# EAGLE design PS2Kbd (EAGLE 6.5.0)
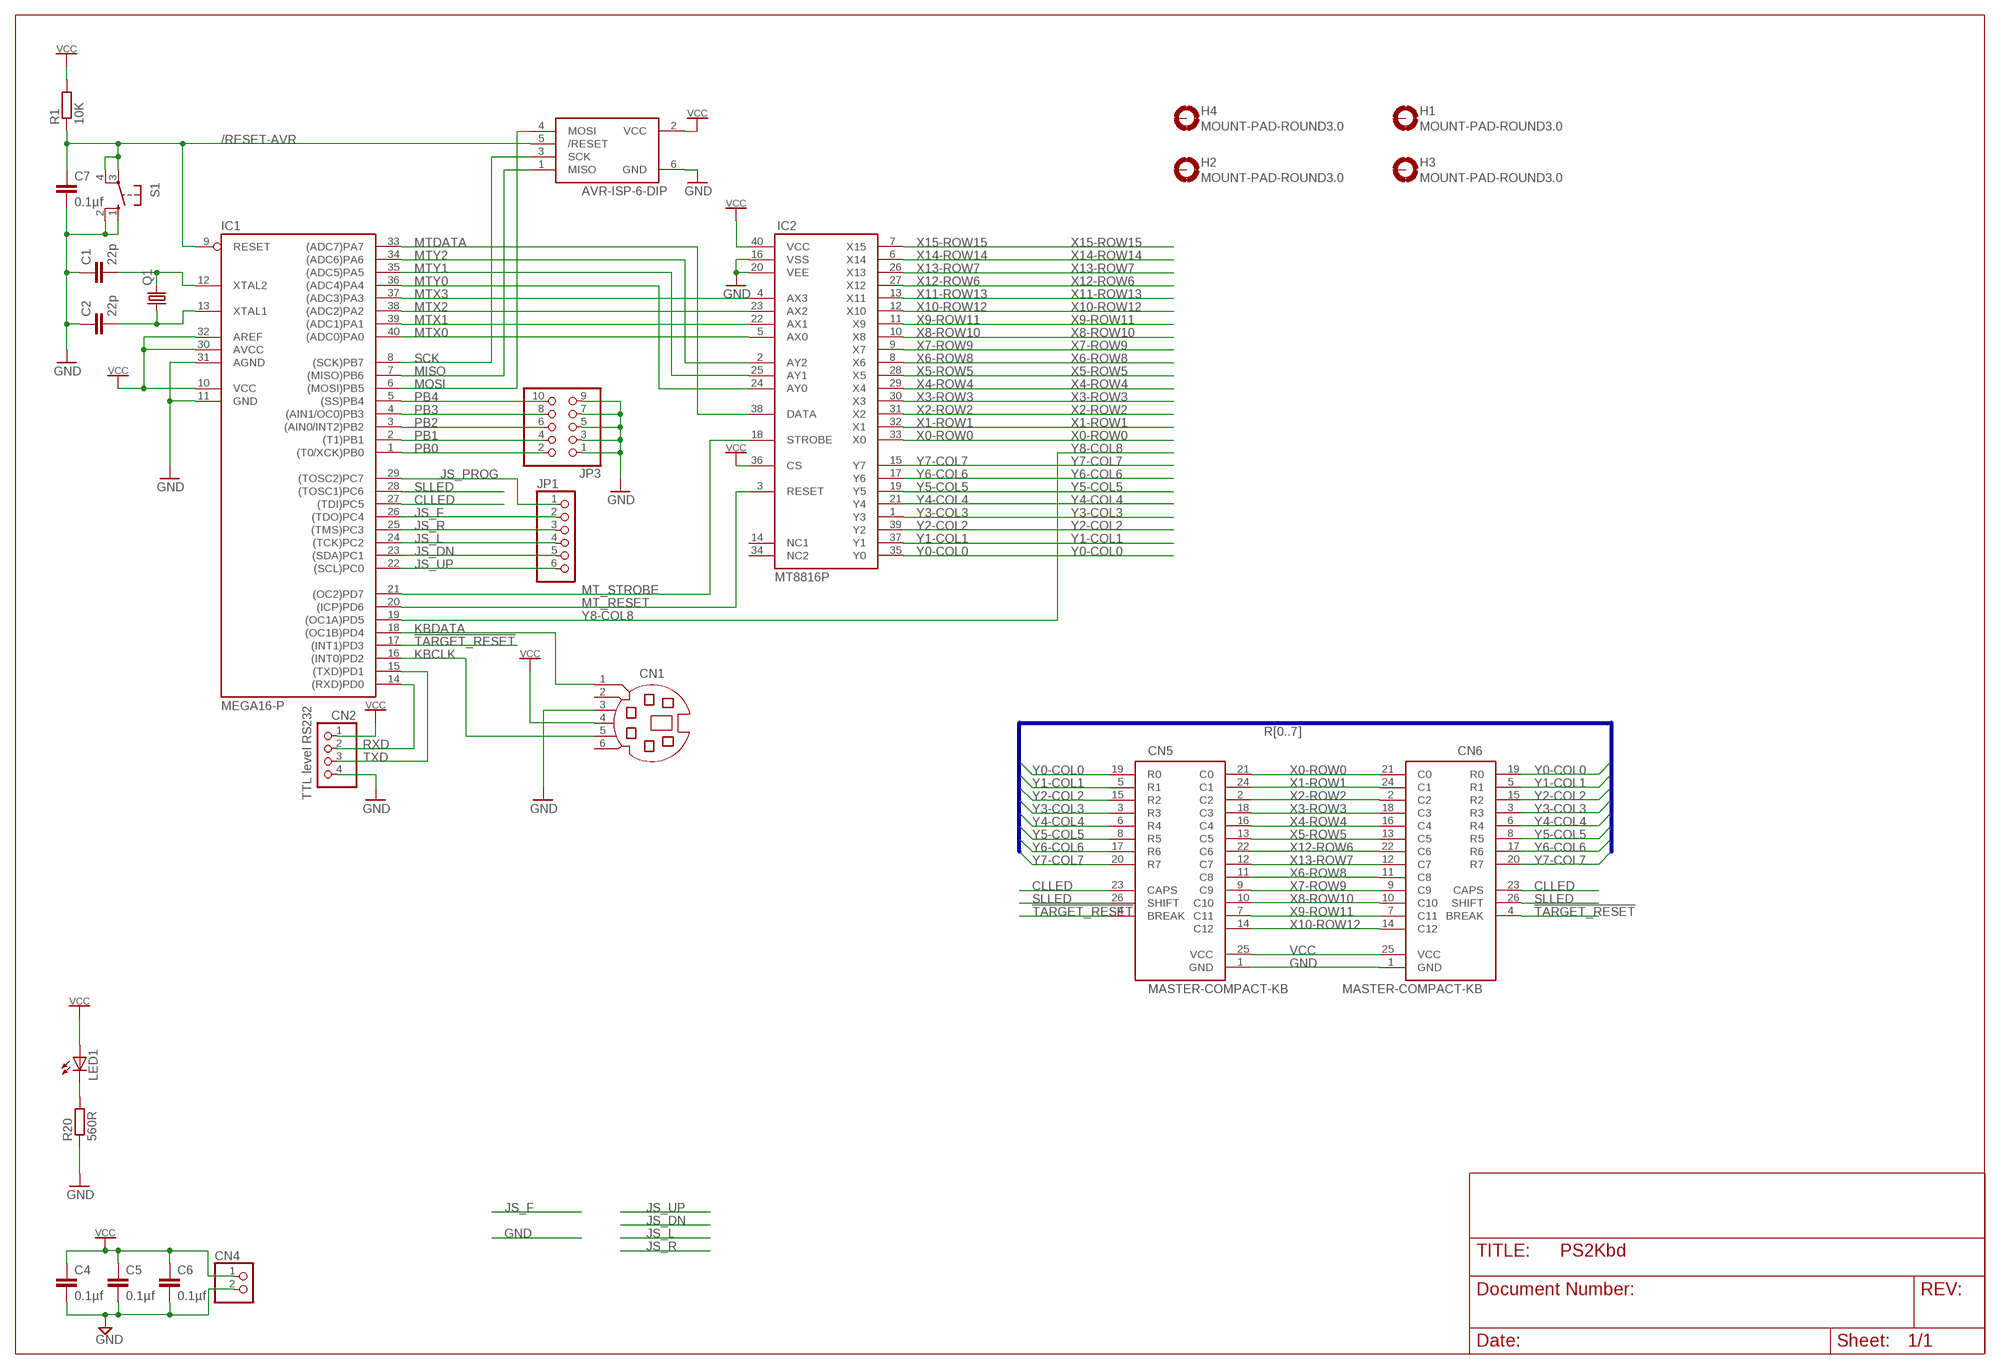
[diagram p0: schematic, sheet 1]

## Parts
C1  22p  C-EU025-025X050  [C025-025X050]
C2  22p  C-EU025-025X050  [C025-025X050]
C4  0.1µf  C-EU025-025X050  [C025-025X050]
C5  0.1µf  C-EU025-025X050  [C025-025X050]
C6  0.1µf  C-EU025-025X050  [C025-025X050]
C7  0.1µf  C-EU025-025X050  [C025-025X050]
CN1  MD06SS  [MDIN06SS]
CN2  PINHD-1X4  [1X04]
CN3  AVR-ISP-6-DIP  [2X3]
CN4  PINHD-1X2  [1X02]
CN5  MASTER-COMPACT-KB  [2X13]
CN6  MASTER-COMPACT-KB  [2X13]
H1  MOUNT-PAD-ROUND3.0  [3,0-PAD]
H2  MOUNT-PAD-ROUND3.0  [3,0-PAD]
H3  MOUNT-PAD-ROUND3.0  [3,0-PAD]
H4  MOUNT-PAD-ROUND3.0  [3,0-PAD]
IC1  MEGA16-P  [DIL40]
IC2  MT8816P  [DIL40]
JP1  PINHD-1X6  [1X06]
JP3  PINHD-2X5  [2X05]
LED1  LED3MM  [LED3MM]
Q1  CRYSTALHC49S  [HC49/S]
R1  10K  R-EU_0207/10  [0207/10]
R20  560R  R-EU_0207/10  [0207/10]
S1  10-XX  [B3F-10XX]

## Nets
!TARGET_RESET: CN5.4(BREAK) CN6.4(BREAK) IC1.17((INT1)PD3)
/RESET-AVR: C7.1 CN3.5(/RESET) IC1.9(RESET) R1.1 S1.3(P) S1.4(P1)
CLLED: CN5.23(CAPS) CN6.23(CAPS) IC1.27((TDI)PC5)
GND: C1.1 C2.1 C4.2 C5.2 C6.2 C7.2 CN1.3 CN2.4 CN3.6(GND) CN4.2 CN5.1(GND) CN6.1(GND) IC1.11(GND) IC1.31(AGND) IC2.16(VSS) IC2.20(VEE) JP3.1 JP3.3 JP3.5 JP3.7 JP3.9 R20.1 S1.1(S) S1.2(S1)
JS_DN: IC1.23((SDA)PC1) JP1.5
JS_F: IC1.26((TDO)PC4) JP1.2
JS_L: IC1.24((TCK)PC2) JP1.4
JS_PROG: IC1.29((TOSC2)PC7) JP1.1
JS_R: IC1.25((TMS)PC3) JP1.3
JS_UP: IC1.22((SCL)PC0) JP1.6
KBCLK: CN1.5 IC1.16((INT0)PD2)
KBDATA: CN1.1 IC1.18((OC1B)PD4)
MISO: CN3.1(MISO) IC1.7((MISO)PB6)
MOSI: CN3.4(MOSI) IC1.6((MOSI)PB5)
MT_RESET: IC1.20((ICP)PD6) IC2.3(RESET)
MT_STROBE: IC1.21((OC2)PD7) IC2.18(STROBE)
MTDATA: IC1.33((ADC7)PA7) IC2.38(DATA)
MTX0: IC1.40((ADC0)PA0) IC2.5(AX0)
MTX1: IC1.39((ADC1)PA1) IC2.22(AX1)
MTX2: IC1.38((ADC2)PA2) IC2.23(AX2)
MTX3: IC1.37((ADC3)PA3) IC2.4(AX3)
MTY0: IC1.36((ADC4)PA4) IC2.24(AY0)
MTY1: IC1.35((ADC5)PA5) IC2.25(AY1)
MTY2: IC1.34((ADC6)PA6) IC2.2(AY2)
N$2: C1.2 IC1.12(XTAL2) Q1.2
N$3: C2.2 IC1.13(XTAL1) Q1.1
N$9: LED1.K(C) R20.2
PB0: IC1.1((T0/XCK)PB0) JP3.2
PB1: IC1.2((T1)PB1) JP3.4
PB2: IC1.3((AIN0/INT2)PB2) JP3.6
PB3: IC1.4((AIN1/OC0)PB3) JP3.8
PB4: IC1.5((SS)PB4) JP3.10
RXD: CN2.2 IC1.14((RXD)PD0)
SCK: CN3.3(SCK) IC1.8((SCK)PB7)
SLLED: CN5.26(SHIFT) CN6.26(SHIFT) IC1.28((TOSC1)PC6)
TXD: CN2.3 IC1.15((TXD)PD1)
VCC: C4.1 C5.1 C6.1 CN1.4 CN2.1 CN3.2(VCC) CN4.1 CN5.25(VCC) CN6.25(VCC) IC1.10(VCC) IC1.30(AVCC) IC1.32(AREF) IC2.36(CS) IC2.40(VCC) LED1.A R1.2
X0-ROW0: CN5.21(C0) CN6.21(C0) IC2.33(X0)
X1-ROW1: CN5.24(C1) CN6.24(C1) IC2.32(X1)
X2-ROW2: CN5.2(C2) CN6.2(C2) IC2.31(X2)
X3-ROW3: CN5.18(C3) CN6.18(C3) IC2.30(X3)
X4-ROW4: CN5.16(C4) CN6.16(C4) IC2.29(X4)
X5-ROW5: CN5.13(C5) CN6.13(C5) IC2.28(X5)
X6-ROW8: CN5.11(C8) CN6.11(C8) IC2.8(X6)
X7-ROW9: CN5.9(C9) CN6.9(C9) IC2.9(X7)
X8-ROW10: CN5.10(C10) CN6.10(C10) IC2.10(X8)
X9-ROW11: CN5.7(C11) CN6.7(C11) IC2.11(X9)
X10-ROW12: CN5.14(C12) CN6.14(C12) IC2.12(X10)
X11-ROW13: IC2.13(X11)
X12-ROW6: CN5.22(C6) CN6.22(C6) IC2.27(X12)
X13-ROW7: CN5.12(C7) CN6.12(C7) IC2.26(X13)
X14-ROW14: IC2.6(X14)
X15-ROW15: IC2.7(X15)
Y0-COL0: CN5.19(R0) CN6.19(R0) IC2.35(Y0)
Y1-COL1: CN5.5(R1) CN6.5(R1) IC2.37(Y1)
Y2-COL2: CN5.15(R2) CN6.15(R2) IC2.39(Y2)
Y3-COL3: CN5.3(R3) CN6.3(R3) IC2.1(Y3)
Y4-COL4: CN5.6(R4) CN6.6(R4) IC2.21(Y4)
Y5-COL5: CN5.8(R5) CN6.8(R5) IC2.19(Y5)
Y6-COL6: CN5.17(R6) CN6.17(R6) IC2.17(Y6)
Y7-COL7: CN5.20(R7) CN6.20(R7) IC2.15(Y7)
Y8-COL8: IC1.19((OC1A)PD5)
Unconnected: CN1.2 CN1.6 H1.B3,0(MOUNT) H2.B3,0(MOUNT) H3.B3,0(MOUNT) H4.B3,0(MOUNT) IC2.14(NC1) IC2.34(NC2)

## Buses
R[0..7]

## Notes on the sheet
- TTL level RS232

## Library data of the parts
C1 C2 C4-C7 = rcl:C-EU: CAPACITOR, European symbol
CN1 = con-yamaichi:MD06SS: YAMAICHI CONNECTOR; OC_FARNELL: unknown; OC_NEWARK: unknown
CN2 = pinhead:PINHD-1X4: PIN HEADER
CN3 = Conn AVR:AVR-ISP-6-DIP
CN4 = pinhead:PINHD-1X2: PIN HEADER
CN5 CN6 = Con-Acorn:MASTER-COMPACT-KB: BBC Master Compact keyboard connector
H1-H4 = holes:MOUNT-PAD-ROUND: MOUNTING PAD, round
IC1 = avr:MEGA16-P: MICROCONTROLLER 16 Kbytes FLASH 1 kbytes SRAM 512 bytes EEPROM USART 8-channel 10 bit ADC
IC2 = Zarlink-crosspoint:MT8816P: Zarlink MT8816P 8 line by 16 line analogue crosspoint switch
JP1 = pinhead-round:PINHD-1X6: PIN HEADER
JP3 = pinhead-round:PINHD-2X5: PIN HEADER
LED1 = led:LED: LED OSRAM: - CHIPLED LG R971, LG N971, LY N971, LG Q971, LY Q971, LO R971, LY R971 LH N974, LH R974 LS Q976, LO Q976, LY Q976 LO Q996 - Hyper CHIPLED LW Q18S LB Q993, LB Q99A, LB R99A - SideLED LS A670, LO A670, LY A670, LG A670, LP A670 LB A673, LV A673, LT A673, LW A673 LH A674 LY A675 LS A676, LA A676, LO A676, LY A676, LW A676 LS A679, LY A679, LG A679 - Hyper Micro SIDELED® LS Y876, LA Y876, LO Y876, LY Y876 LT Y87S - SmartLED LW L88C, LW L88S LB L89C, LB L89S, LG L890 LS L89K, LO L89K, LY L89K LS L896, LA L896, LO L896, LY L896 - TOPLED LS T670, LO T670, LY T670, LG T670, LP T670 LSG T670, LSP T670, LSY T670, LOP T670, LYG T670 LG T671, LOG T671, LSG T671 LB T673, LV T673, LT T673, LW T673 LH T674 LS T676, LA T676, LO T676, LY T676, LB T676, LH T676, LSB T676, LW T676 LB T67C, LV T67C, LT T67C, LS T67K, LO T67K, LY T67K, LW E67C LS E67B, LA E67B, LO E67B, LY E67B, LB E67C, LV E67C, LT E67C LW T67C LS T679, LY T679, LG T679 LS T770, LO T770, LY T770, LG T770, LP T770 LB T773, LV T773, LT T773, LW T773 LH T774 LS E675, LA E675, LY E675, LS T675 LS T776, LA T776, LO T776, LY T776, LB T776 LHGB T686 LT T68C, LB T68C - Hyper Mini TOPLED® LB M676 - Mini TOPLED Santana® LG M470 LS M47K, LO M47K, LY M47K Source: http://www.osram.convergy.de LUXEON: - LUMILED® LXK2-PW12-R00, LXK2-PW12-S00, LXK2-PW14-U00, LXK2-PW14-V00 LXK2-PM12-R00, LXK2-PM12-S00, LXK2-PM14-U00 LXK2-PE12-Q00, LXK2-PE12-R00, LXK2-PE12-S00, LXK2-PE14-T00, LXK2-PE14-U00 LXK2-PB12-K00, LXK2-PB12-L00, LXK2-PB12-M00, LXK2-PB14-N00, LXK2-PB14-P00, LXK2-PB14-Q00 LXK2-PR12-L00, LXK2-PR12-M00, LXK2-PR14-Q00, LXK2-PR14-R00 LXK2-PD12-Q00, LXK2-PD12-R00, LXK2-PD12-S00 LXK2-PH12-R00, LXK2-PH12-S00 LXK2-PL12-P00, LXK2-PL12-Q00, LXK2-PL12-R00 Source: www.luxeon.com KINGBRIGHT: KA-3528ASYC Source: www.kingbright.com
Q1 = crystal:CRYSTAL: CRYSTAL; OC_FARNELL: 1667008; OC_NEWARK: unknown
R1 R20 = rcl:R-EU_: RESISTOR, European symbol
S1 = switch-omron:10-XX: OMRON SWITCH; MPN: B3F-1000; OC_FARNELL: 176432; OC_NEWARK: 36M3542

## Board
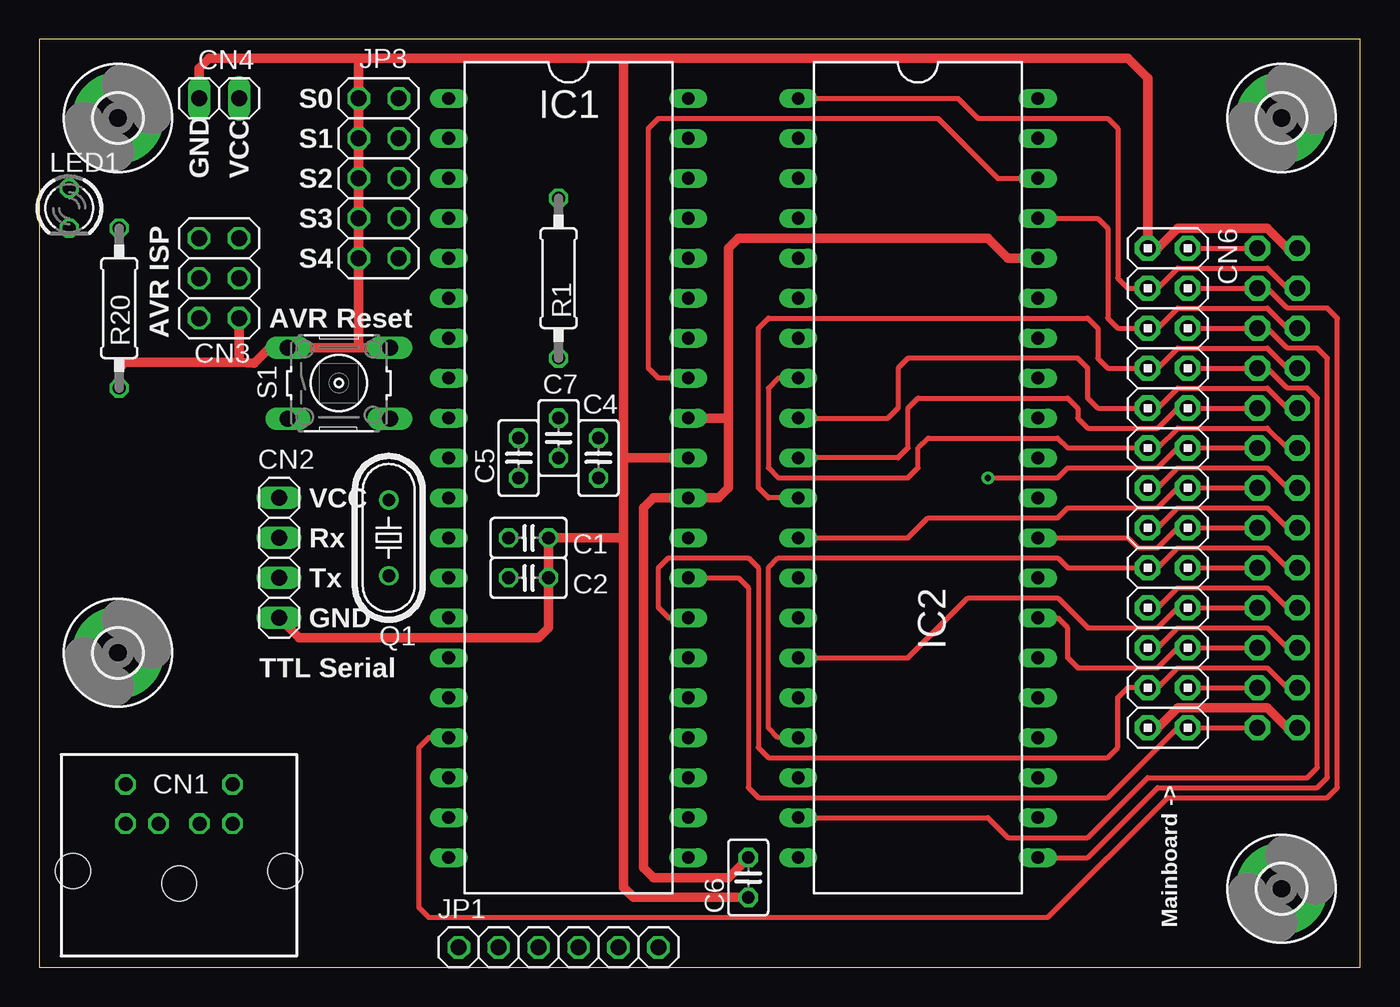
[diagram p1: board, top side]
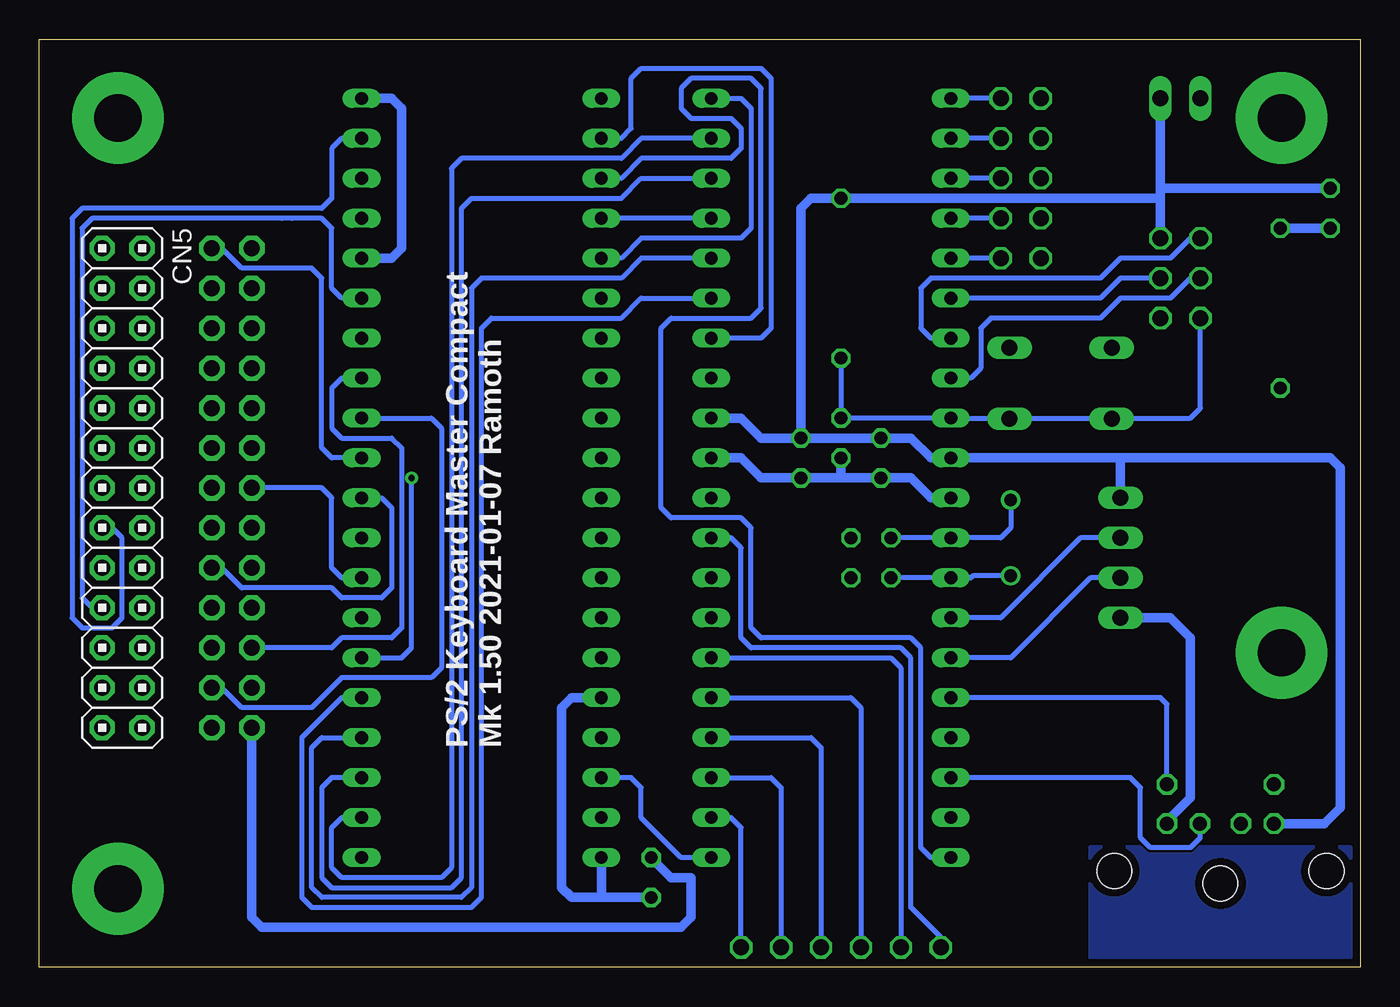
[diagram p2: board, bottom side, seen from below]

Size 84 x 59 mm. Coordinates in mm from the lower left corner, seen from the top.
Outline: 0,0 84,0 84,59 0,59 0,0
Copper layers (1*16): Top 0.035mm / dielectric 1.5mm / Bottom 0.035mm
Design rules "mrb": minimum track width 10mil, minimum drill 10mil, track to track 6mil, track to pad 6mil, pad to pad 6mil, via to via 6mil, smd to smd 6mil, copper to edge 20mil, drill to drill 8mil, minimum pad ring 8mil, minimum via ring 8mil, stop-mask expansion 4mil, vias tented up to drill 0mil, thermal gap 10mil

### Footprints (pad centres in the part's own frame; a part is rotated, then mirrored left to right if it is on the bottom)
C025-025X050 = drill 0.813 octagon: 1 -1.27,0; 2 1.27,0
MDIN06SS = drill 0.9 octagon: 1 1.3,8.5; 2 -1.3,8.5; 3 3.4,8.5; 4 -3.4,8.5; 5 3.4,11; 6 -3.4,11 | hole 2.2: -6.75,5.5; 0,4.7; 6.75,5.5
1X04 = drill 1.016 long: 1 -3.81,0; 2 -1.27,0; 3 1.27,0; 4 3.81,0
2X3 = drill 1.016 octagon: 1 -2.54,-1.27; 2 -2.54,1.27; 3 0,-1.27; 4 0,1.27; 5 2.54,-1.27; 6 2.54,1.27
1X02 = drill 1.016 long: 1 -1.27,0; 2 1.27,0
2X13 = drill 1.016 pad 1.6 octagon: 1 -15.24,-1.27; 2 -15.24,1.27; 3 -12.7,-1.27; 4 -12.7,1.27; 5 -10.16,-1.27; 6 -10.16,1.27; 7 -7.62,-1.27; 8 -7.62,1.27; 9 -5.08,-1.27; 10 -5.08,1.27; 11 -2.54,-1.27; 12 -2.54,1.27; 13 0,-1.27; 14 0,1.27; 15 2.54,-1.27; 16 2.54,1.27; 17 5.08,-1.27; 18 5.08,1.27; 19 7.62,-1.27; 20 7.62,1.27; 21 10.16,-1.27; 22 10.16,1.27; 23 12.7,-1.27; 24 12.7,1.27; 25 15.24,-1.27; 26 15.24,1.27
3,0-PAD = drill 3 pad 5.842: B3,0 0,0
DIL40 = drill 0.813 long: 1 -24.13,-7.62; 2 -21.59,-7.62; 3 -19.05,-7.62; 4 -16.51,-7.62; 5 -13.97,-7.62; 6 -11.43,-7.62; 7 -8.89,-7.62; 8 -6.35,-7.62; 9 -3.81,-7.62; 10 -1.27,-7.62; 11 1.27,-7.62; 12 3.81,-7.62; 13 6.35,-7.62; 14 8.89,-7.62; 15 11.43,-7.62; 16 13.97,-7.62; 17 16.51,-7.62; 18 19.05,-7.62; 19 21.59,-7.62; 20 24.13,-7.62; 21 24.13,7.62; 22 21.59,7.62; 23 19.05,7.62; 24 16.51,7.62; 25 13.97,7.62; 26 11.43,7.62; 27 8.89,7.62; 28 6.35,7.62; 29 3.81,7.62; 30 1.27,7.62; 31 -1.27,7.62; 32 -3.81,7.62; 33 -6.35,7.62; 34 -8.89,7.62; 35 -11.43,7.62; 36 -13.97,7.62; 37 -16.51,7.62; 38 -19.05,7.62; 39 -21.59,7.62; 40 -24.13,7.62
1X06 = drill 1.016 octagon: 1 -6.35,0; 2 -3.81,0; 3 -1.27,0; 4 1.27,0; 5 3.81,0; 6 6.35,0
2X05 = drill 1.016 octagon: 1 -5.08,-1.27; 2 -5.08,1.27; 3 -2.54,-1.27; 4 -2.54,1.27; 5 0,-1.27; 6 0,1.27; 7 2.54,-1.27; 8 2.54,1.27; 9 5.08,-1.27; 10 5.08,1.27
LED3MM = drill 0.813 octagon: A -1.27,0; K 1.27,0
HC49/S = drill 0.813: 1 -2.413,0; 2 2.413,0
0207/10 = drill 0.813 octagon: 1 -5.08,0; 2 5.08,0
B3F-10XX = drill 1.016 long: 1 -3.251,2.261; 2 3.251,2.261; 3 -3.251,-2.261; 4 3.251,-2.261

### Placement (x,y rotation side)
C1  31.11,27.3 180 top
C2  31.11,24.77 180 top
C4  35.56,32.38 270 top
C5  30.48,32.38 270 top
C6  45.09,5.71 270 top
C7  33.02,33.66 270 top
CN1  8.89,0.64 0 top
CN2  15.24,26.04 270 top
CN3  11.43,43.81 270 top
CN4  11.43,55.24 180 top
CN5  78.74,30.48 270 bottom
CN6  71.75,30.48 270 top
H1  5,20 0 top
H2  79,54 0 top
H3  79,5 0 top
H4  5,54 0 top
IC1  33.66,31.11 270 top
IC2  55.88,31.11 270 top
JP1  33.02,1.27 0 top
JP3  21.59,50.16 270 top
LED1  1.91,48.26 270 top
Q1  22.23,27.3 90 top
R1  33.02,43.81 90 top
R20  5.08,41.91 90 top
S1  19.05,37.15 0 top

### Tracks (layer width: path | path; a pad name or v marks a point on that pad's centre or on a via)
!TARGET_RESET
  Top 0.305: CN6.4 CN5.4 78.11,43.18 79.38,41.91 81.92,41.91 82.55,41.27 82.55,11.43 81.92,10.79 71.75,10.79 64.14,3.17 24.77,3.17 24.13,3.81 24.13,13.97 24.77,14.61 IC1.17
/RESET-AVR
  Bottom 0.305: IC1.9 C7.1 R1.1 | IC1.9 22.34,34.92 S1.4 | IC1.9 15.84,34.92 | 15.84,34.92 S1.3 | 15.84,34.92 10.79,34.92 10.16,35.56 CN3.5
CLLED
  Top 0.305: CN5.23 79.38,17.78 78.11,19.05 72.39,19.05 71.12,17.78 CN6.23 69.22,17.78 68.58,17.14 68.58,13.97 67.94,13.34 46.35,13.34 45.72,13.97 45.72,25.4 45.09,26.04 40.01,26.04 39.37,25.4 39.37,22.86 40.01,22.23 IC1.27
GND
  Top 0.61: 37.15,57.78 20.32,57.78 | 20.32,57.78 10.79,57.78 10.16,57.15 CN4.2 | 37.15,57.78 37.15,32.38 | 37.15,32.38 37.15,27.3 | 37.15,27.3 37.15,5.08 37.78,4.45 C6.2 | IC1.31 37.15,32.38 | CN2.4 16.51,20.95 31.75,20.95 32.38,21.59 C2.1 C1.1 37.15,27.3 | S1.2 20.32,39.41 | 20.32,39.41 S1.1 14.64,39.41 13.65,38.42 12.7,38.46 | 12.7,38.46 5.44,38.46 5.08,38.1 R20.1 | CN3.6 12.7,38.46 | 20.32,57.78 JP3.1 JP3.3 JP3.5 JP3.7 JP3.9 20.32,39.41 | CN5.1 79.38,45.72 78.11,46.99 72.39,46.99 71.12,45.72 CN6.1 70.48,56.52 69.22,57.78 37.15,57.78
  Bottom 0.61: IC1.11 27.3,29.84 28.57,31.11 C5.2 33.02,31.11 | 33.02,31.11 C4.2 38.1,31.11 39.37,32.38 IC1.31 | C6.2 48.26,4.45 | 48.26,4.45 50.16,4.45 50.8,5.08 50.8,16.51 50.16,17.14 IC2.16 | IC2.20 48.26,4.45 | C7.2 33.02,31.11 | CN1.3 12.29,9.3 10.79,10.79 10.79,20.95 12.06,22.23 CN2.4
JS_DN
  Bottom 0.305: IC1.23 37.47,12.06 36.83,11.43 JP1.5
JS_F
  Bottom 0.305: IC1.26 29.84,19.68 29.21,19.05 JP1.2
JS_L
  Bottom 0.305: IC1.24 34.92,14.61 34.29,13.97 JP1.4
JS_PROG
  Bottom 0.305: JP1.1 26.67,1.91 28.57,3.81 28.57,19.68 29.21,20.32 38.73,20.32 39.37,20.95 39.37,26.67 40.01,27.3 IC1.29
JS_R
  Bottom 0.305: IC1.25 32.38,17.14 31.75,16.51 JP1.3
JS_UP
  Bottom 0.305: JP1.6 39.37,8.89 40.01,9.53 IC1.22
KBCLK
  Bottom 0.305: CN1.5 12.29,16.73 12.7,17.14 IC1.16
KBDATA
  Bottom 0.305: IC1.18 14.61,12.06 13.97,11.43 13.97,8.26 13.34,7.62 10.79,7.62 10.19,8.22 CN1.1
MISO
  Bottom 0.305: CN3.1 10.79,46.35 12.06,45.09 15.24,45.09 16.51,43.81 27.3,43.81 27.94,43.18 27.94,40.64 27.3,40.01 IC1.7
MOSI
  Bottom 0.305: CN3.4 15.24,43.81 16.51,42.55 IC1.6
MT_RESET
  Bottom 0.305: IC1.20 27.3,6.99 27.94,7.62 27.94,20.32 28.57,20.95 38.1,20.95 38.73,21.59 38.73,27.94 39.37,28.57 43.81,28.57 44.45,29.21 44.45,40.64 43.81,41.27 38.73,41.27 38.1,41.91 38.1,55.88 38.73,56.52 42.55,56.52 43.18,55.88 43.18,54.61 42.55,53.98 40.01,53.98 39.37,53.34 39.37,52.07 40.01,51.44 45.72,51.44 46.99,50.16 IC2.3
MT_STROBE
  Bottom 0.305: IC1.21 43.18,6.99 45.72,9.53 45.72,11.43 46.35,12.06 IC2.18
MTDATA
  Top 0.305: IC1.33 39.37,37.47 38.73,38.1 38.73,53.34 39.37,53.98 57.15,53.98 60.96,50.16 IC2.38
MTX0
  Bottom 0.305: IC1.40 39.37,55.24 38.73,54.61 38.73,46.99 39.37,46.35 45.72,46.35 46.99,45.09 IC2.5
MTX1
  Bottom 0.305: IC1.39 45.72,52.7 46.99,51.44 57.15,51.44 57.78,50.8 57.78,6.35 58.42,5.71 64.77,5.71 65.41,6.35 65.41,8.89 64.77,9.53 IC2.22
MTX2
  Bottom 0.305: IC2.23 65.41,12.06 66.04,11.43 66.04,5.71 65.41,5.08 57.78,5.08 57.15,5.71 57.15,48.26 56.52,48.9 46.99,48.9 45.72,50.16 IC1.38
MTX3
  Bottom 0.305: IC1.37 IC2.4
MTY0
  Bottom 0.305: IC1.36 45.72,45.09 46.99,43.81 55.88,43.81 56.52,43.18 56.52,5.08 57.15,4.45 66.04,4.45 66.67,5.08 66.67,13.97 66.04,14.61 IC2.24
MTY1
  Bottom 0.305: IC2.25 64.77,17.14 67.31,14.61 67.31,4.45 66.67,3.81 56.52,3.81 55.88,4.45 55.88,40.64 55.24,41.27 46.99,41.27 45.72,42.55 IC1.35
MTY2
  Bottom 0.305: IC2.2 46.99,52.7 46.35,53.34 46.35,56.52 45.72,57.15 38.1,57.15 37.47,56.52 37.47,40.64 38.1,40.01 IC1.34
N$2
  Bottom 0.305: C1.2 IC1.12 22.86,27.3 22.23,27.94 Q1.2
N$3
  Bottom 0.305: C2.2 IC1.13 24.77,24.77 24.64,24.89 Q1.1
N$4
  pour Bottom: 0.64,0.64 0.64,7.62 17.14,7.62 17.14,0.64
N$9
  Bottom 0.61: LED1.K R20.2
PB0
  Bottom 0.305: JP3.2 IC1.1
PB1
  Bottom 0.305: JP3.4 IC1.2
PB2
  Bottom 0.305: JP3.6 IC1.3
PB3
  Bottom 0.305: JP3.8 IC1.4
PB4
  Bottom 0.305: JP3.10 IC1.5
RXD
  Bottom 0.305: CN2.2 17.78,27.3 22.86,22.23 IC1.14
SCK
  Bottom 0.305: CN3.3 10.79,43.81 12.06,42.55 15.24,42.55 16.51,41.27 23.5,41.27 24.13,40.64 24.13,38.1 24.77,37.47 IC1.8
SLLED
  Top 0.305: CN5.26 CN6.26 72.39,15.24 67.94,10.79 45.72,10.79 45.09,11.43 45.09,24.13 44.45,24.77 IC1.28
TXD
  Bottom 0.305: CN2.3 17.14,24.77 22.23,19.68 IC1.15
VCC
  Top 0.61: C6.1 43.81,5.71 39.05,5.71 38.42,6.35 38.42,29.21 39.05,29.84 IC1.30 43.18,29.84 43.81,30.48 43.81,34.92 | CN6.25 71.12,15.24 72.39,16.51 78.11,16.51 79.38,15.24 CN5.25 | IC1.32 43.81,34.92 | 43.81,34.92 43.81,45.72 44.45,46.35 60.33,46.35 61.59,45.09 IC2.36
  Bottom 0.61: C4.1 C5.1 28.57,33.66 27.3,32.38 IC1.10 15.24,32.38 | CN2.1 15.24,32.38 | C4.1 35.56,48.26 34.92,48.9 R1.2 12.7,48.9 | C4.1 38.1,33.66 39.37,34.92 IC1.32 | CN4.1 12.7,49.53 | 12.7,49.53 12.7,48.9 | 12.7,48.9 CN3.2 | LED1.A 12.7,49.53 | C6.1 43.81,5.71 42.55,5.71 42.55,3.17 43.18,2.54 69.85,2.54 70.48,3.17 CN6.25 | IC2.40 61.59,55.24 60.96,54.61 60.96,45.72 61.59,45.09 IC2.36 | CN1.4 2.29,9.13 1.27,10.16 1.27,31.75 1.91,32.38 15.24,32.38
X0-ROW0
  Top 0.305: CN6.21 71.12,20.32 72.39,21.59 78.11,21.59 79.38,20.32 CN5.21
  Bottom 0.305: IC2.33 64.77,37.47 65.41,36.83 65.41,34.29 64.77,33.66 61.59,33.66 60.96,33.02 60.96,21.59 61.59,20.95 64.77,20.95 65.41,20.32 CN6.21
X1-ROW1
  Top 0.305: CN6.24 CN5.24
  Bottom 0.305: IC2.32 59.05,34.92 58.42,34.29 58.42,19.05 59.05,18.41 64.77,18.41 66.67,16.51 71.12,16.51 72.39,17.78 CN6.24
X2-ROW2
  Top 0.305: CN6.2 CN5.2
  Bottom 0.305: IC2.31 65.41,32.38 66.04,33.02 66.04,43.81 66.67,44.45 71.12,44.45 72.39,45.72 CN6.2
X3-ROW3
  Top 0.305: CN6.18 CN5.18
  Bottom 0.305: IC2.30 62.23,29.84 61.59,29.21 61.59,24.13 62.23,23.5 64.77,23.5 65.41,24.13 71.12,24.13 72.39,25.4 CN6.18
X4-ROW4
  Top 0.305: CN5.16 CN6.16 72.39,27.94 71.12,26.67 69.85,26.67 69.22,27.3 IC2.29
X5-ROW5
  Top 0.305: CN6.13 71.12,30.48 72.39,31.75 78.11,31.75 79.38,30.48 CN5.13
  Bottom 0.305: IC2.28 64.77,24.77 65.41,25.4 65.41,29.84 66.04,30.48 CN6.13
X6-ROW8
  Top 0.305: CN5.11 79.38,33.02 78.11,34.29 72.39,34.29 71.12,33.02 CN6.11 65.41,33.02 64.77,33.66 56.52,33.66 55.88,33.02 55.88,31.75 55.24,31.11 46.99,31.11 46.35,31.75 46.35,36.83 46.99,37.47 IC2.8
X7-ROW9
  Top 0.305: CN5.9 79.38,35.56 78.11,36.83 72.39,36.83 71.12,35.56 CN6.9 67.31,35.56 66.67,36.2 66.67,38.1 66.04,38.73 55.24,38.73 54.61,38.1 54.61,35.56 53.98,34.92 IC2.9
X8-ROW10
  Top 0.305: CN5.10 CN6.10 72.39,35.56 71.12,34.29 66.67,34.29 66.04,34.92 66.04,35.56 65.41,36.2 55.88,36.2 55.24,35.56 55.24,33.02 54.61,32.38 IC2.10
X9-ROW11
  Top 0.305: CN5.7 79.38,38.1 78.11,39.37 72.39,39.37 71.12,38.1 CN6.7 67.94,38.1 67.31,38.73 67.31,40.64 66.67,41.27 46.35,41.27 45.72,40.64 45.72,30.48 46.35,29.84 IC2.11
X10-ROW12
  Top 0.305: CN5.14 CN6.14 72.39,30.48 71.12,29.21 65.41,29.21 64.77,28.57 56.52,28.57 55.24,27.3 IC2.12
X12-ROW6
  Top 0.305: CN5.22 CN6.22 72.39,20.32 71.12,19.05 66.04,19.05 65.41,19.68 65.41,21.59 64.77,22.23 IC2.27
X13-ROW7  (via drill 0.4)
  Top 0.305: CN5.12 CN6.12 72.39,33.02 71.12,31.75 65.41,31.75 64.77,31.11 v60.33,31.11
  Bottom 0.305: IC2.26 60.96,19.68 60.33,20.32 v60.33,31.11
Y0-COL0
  Top 0.305: CN6.19 71.12,22.86 72.39,24.13 78.11,24.13 79.38,22.86 CN5.19
  Bottom 0.305: IC2.35 64.77,42.55 65.41,43.18 65.41,46.99 66.04,47.62 67.94,47.62 68.58,47.62 80.64,47.62 81.28,46.99 81.28,23.5 80.64,22.86 CN5.19
Y1-COL1
  Top 0.305: CN5.5 79.38,40.64 78.11,41.91 72.39,41.91 71.12,40.64 CN6.5 68.58,40.64 67.94,41.27 67.94,46.99 67.31,47.62 IC2.37
Y2-COL2
  Top 0.305: CN6.15 71.12,27.94 72.39,29.21 78.11,29.21 79.38,27.94 CN5.15
  Bottom 0.305: IC2.39 64.77,52.7 65.41,52.07 65.41,48.9 66.04,48.26 81.28,48.26 81.92,47.62 81.92,22.23 81.28,21.59 79.38,21.59 78.74,22.23 78.74,27.3 79.38,27.94 CN5.15
Y3-COL3
  Top 0.305: CN5.3 79.38,43.18 78.11,44.45 72.39,44.45 71.12,43.18 CN6.3 69.22,43.18 68.58,43.81 68.58,53.34 67.94,53.98 59.69,53.98 58.42,55.24 IC2.1
Y4-COL4
  Top 0.305: CN6.6 CN5.6 78.11,40.64 79.38,39.37 81.28,39.37 81.92,38.73 81.92,12.06 81.28,11.43 71.12,11.43 66.67,6.99 IC2.21
Y5-COL5
  Top 0.305: CN6.8 CN5.8 78.11,38.1 79.38,36.83 80.64,36.83 81.28,36.2 81.28,12.7 80.64,12.06 70.48,12.06 66.67,8.26 61.59,8.26 60.33,9.53 IC2.19
Y6-COL6
  Top 0.305: CN5.17 79.38,25.4 78.11,26.67 72.39,26.67 71.12,25.4 CN6.17 65.41,25.4 64.77,26.04 46.99,26.04 46.35,25.4 46.35,15.24 46.99,14.61 IC2.17
Y7-COL7
  Top 0.305: CN5.20 CN6.20 72.39,22.86 71.12,21.59 66.67,21.59 64.77,23.5 59.05,23.5 55.24,19.68 IC2.15

### Text on the board
tPlace: S0 | S1 | GND | VCC | S2 | S3 | S4 | AVR Reset | AVR ISP | VCC | Rx | Tx | GND | TTL Serial | Mainboard ->
bPlace: PS/2 Keyboard Master Compact / Mk 1.50 2021-01-07 Ramoth
Document: Gnd | R2 | C3 | !rs | C1 | C4 | R11 | C5 | R9 | R10 | R8 | R7 | R5 | R12 | C2 | R4 | C6 | R3 | C0 | C7 | R0 | R6 | CL | R1 | V | SL